# EAGLE board Glowdeck_beta_proto (EAGLE 6.3), part 1 of 2
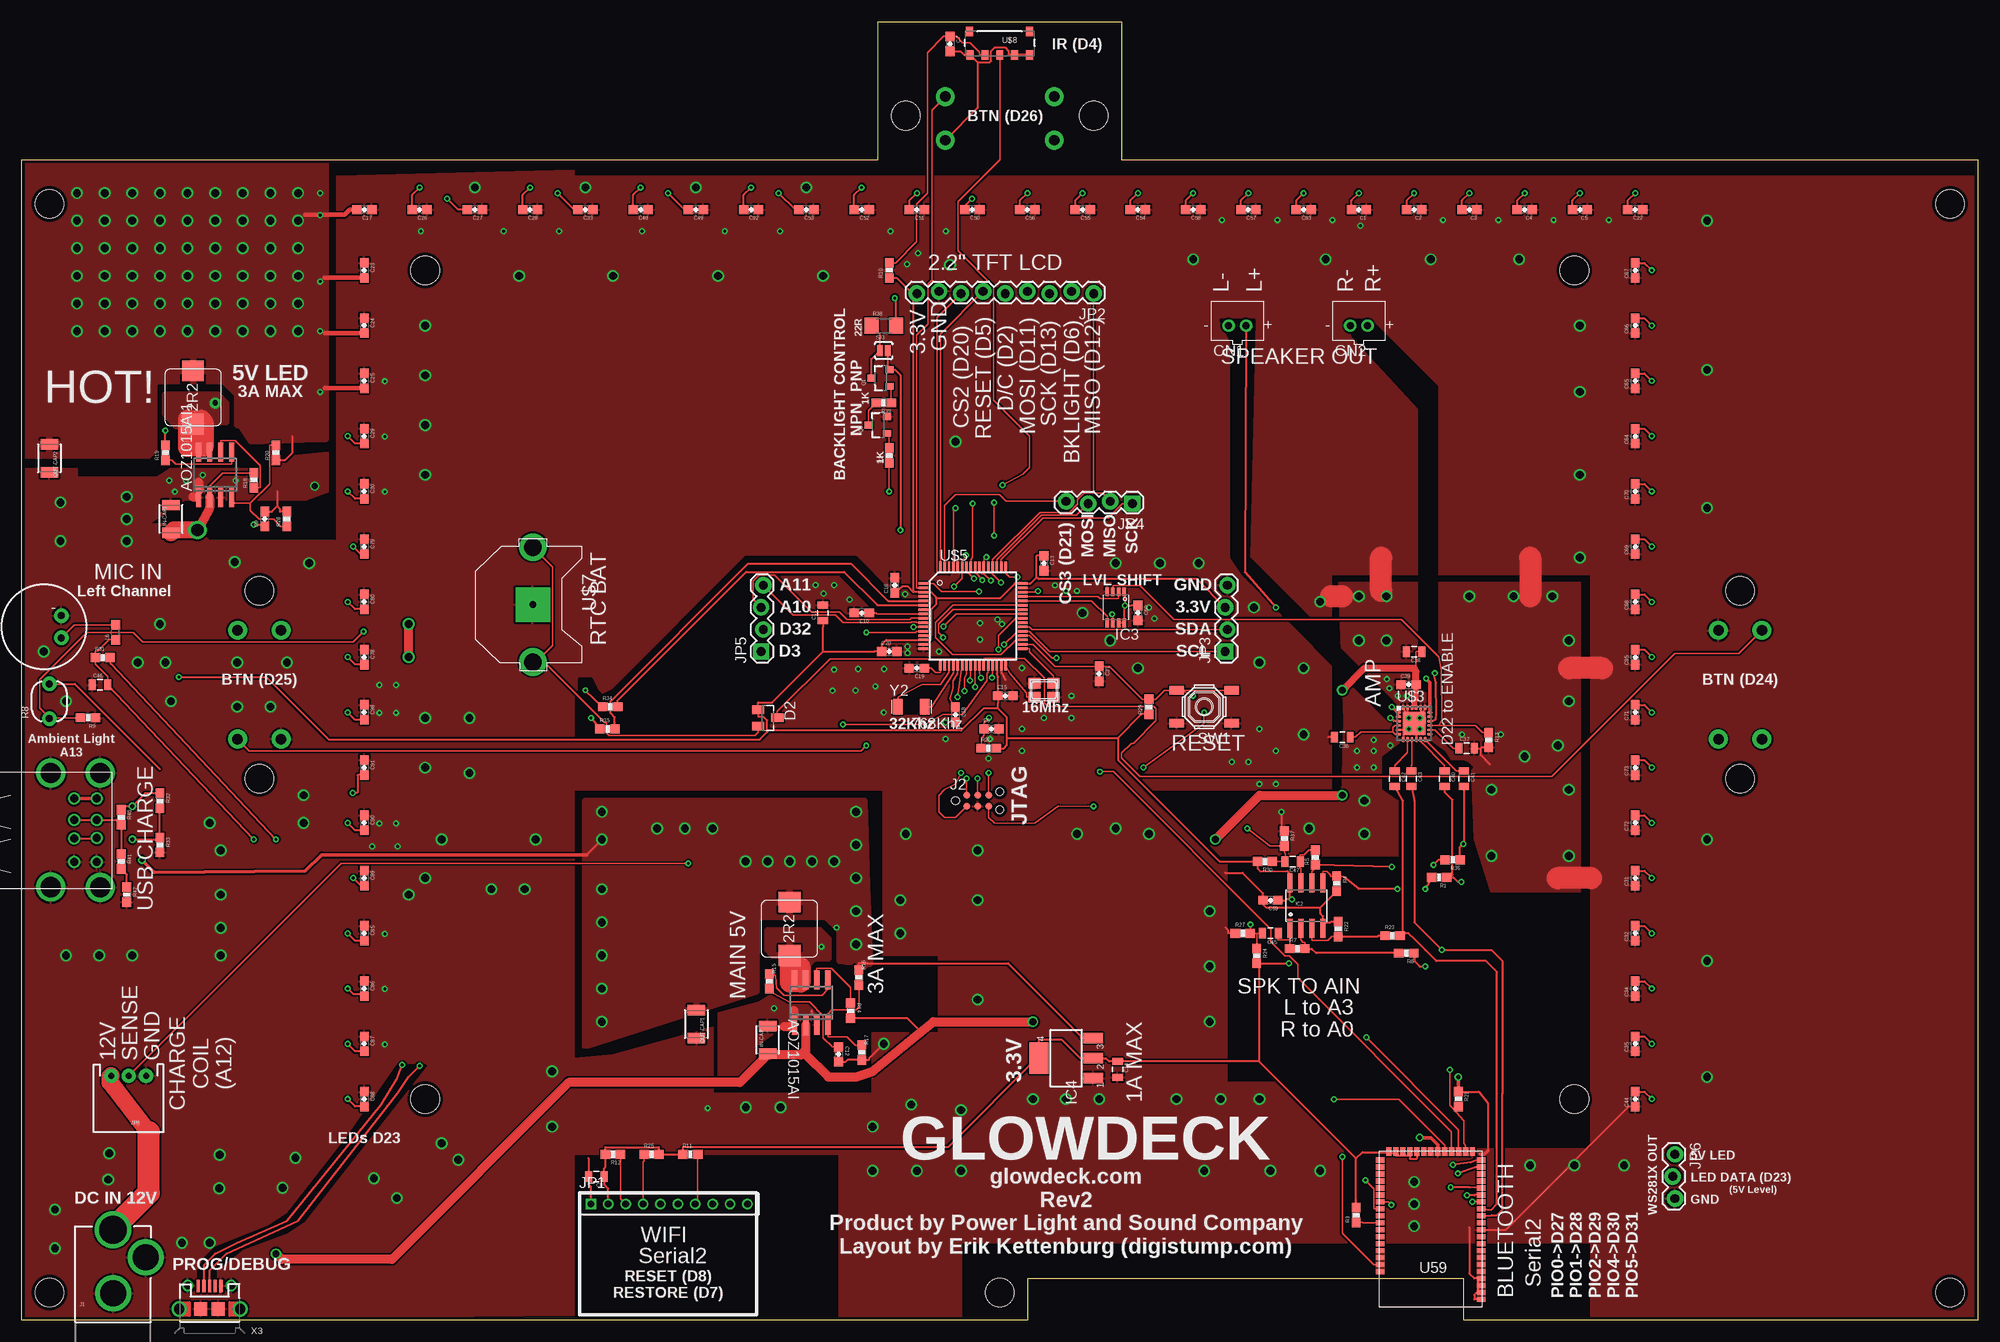
[diagram p12: board, top side]
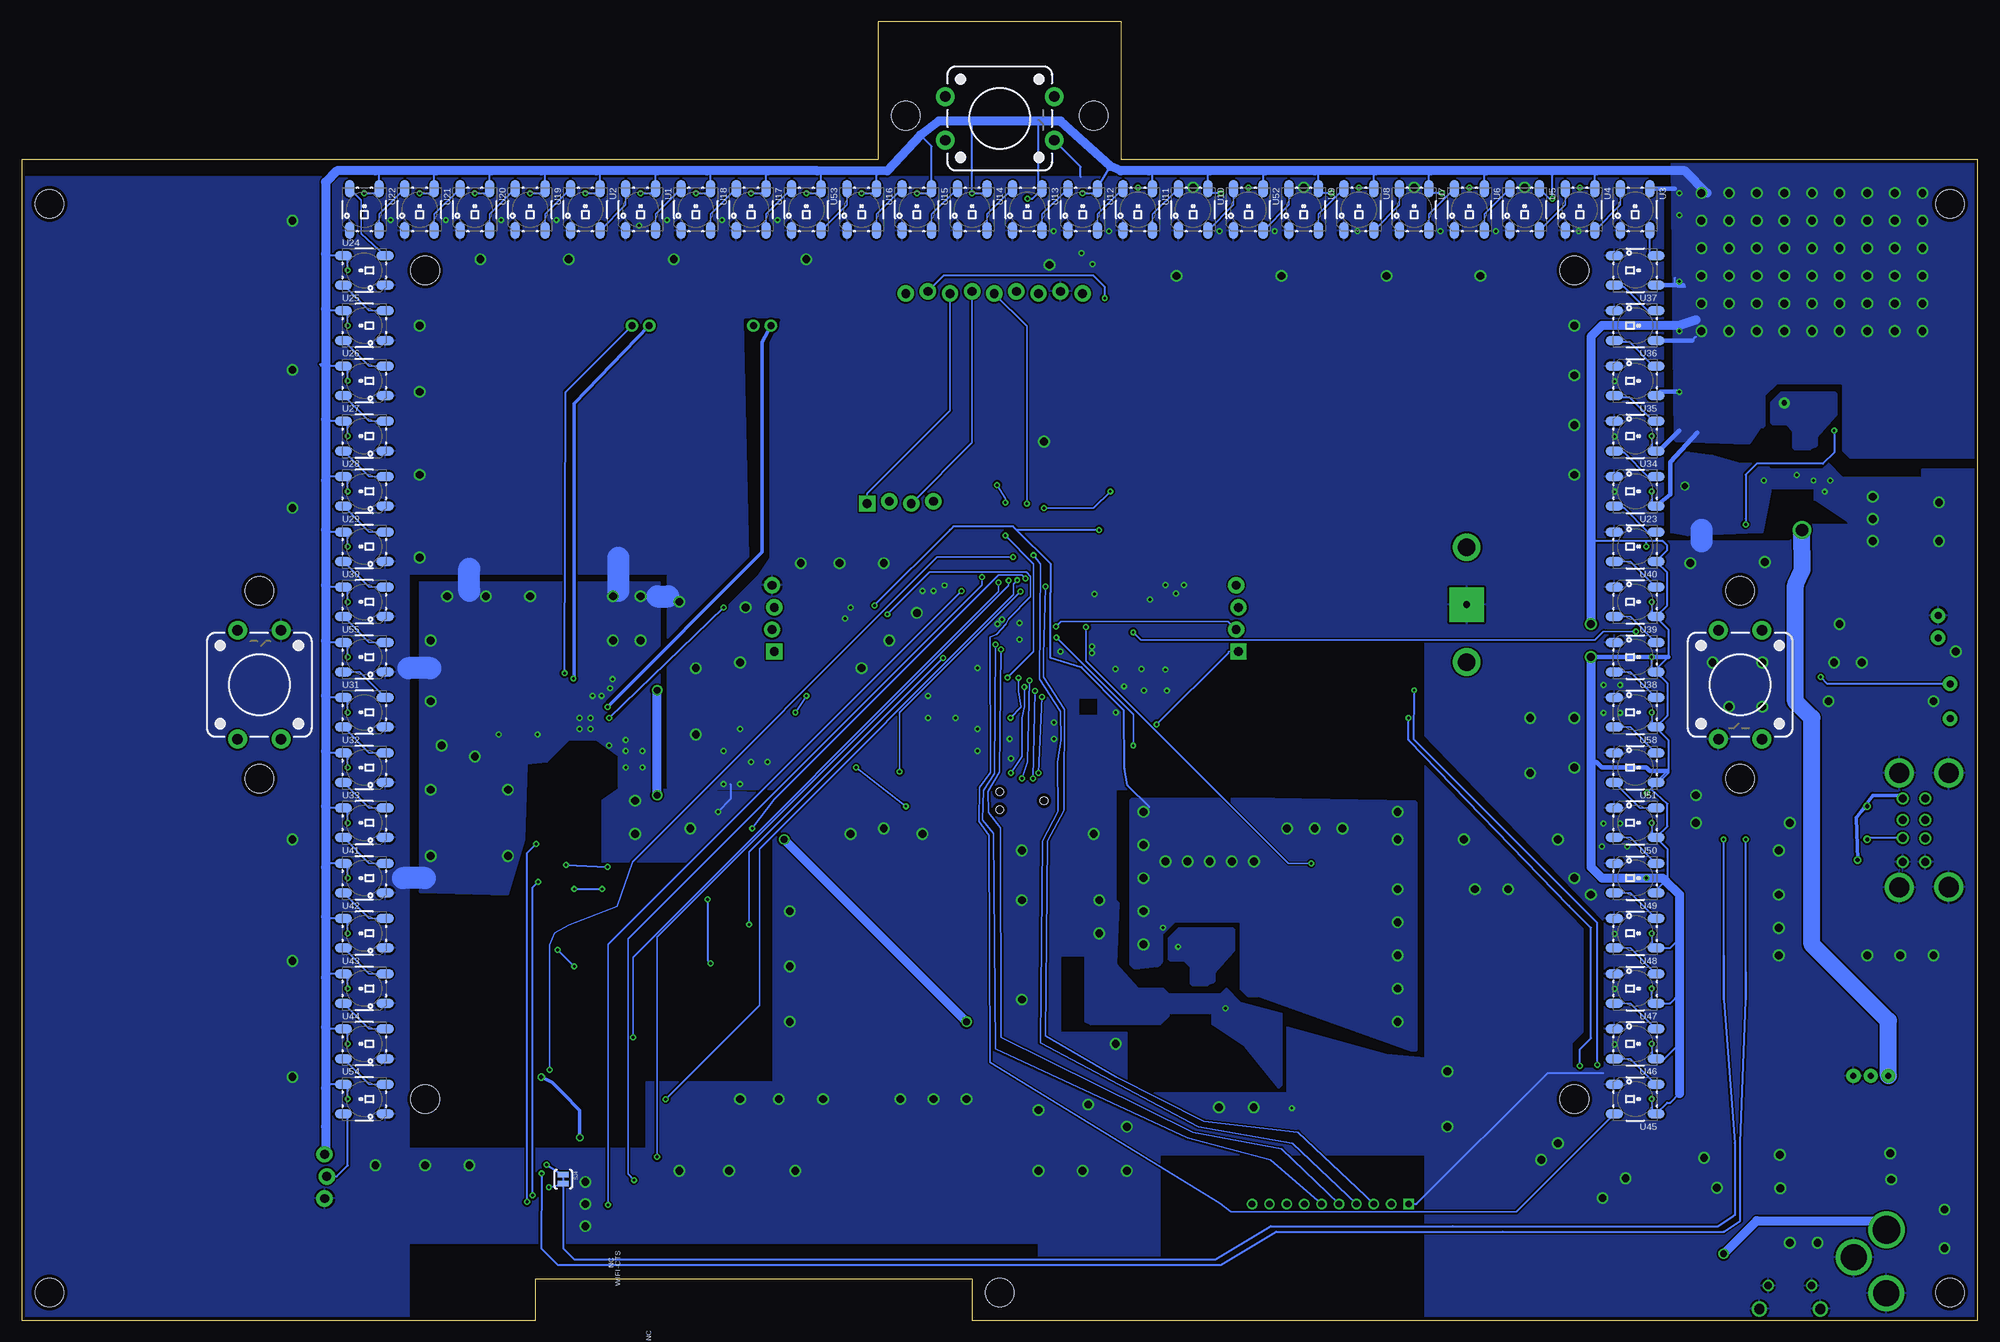
[diagram p13: board, bottom side, seen from below]

Size 224.79 x 149.22 mm. Coordinates in mm from the lower left corner, seen from the top.
Outline: 224.79,0 199.39,0 189.23,0 165.74,0 165.74,4.75 115.57,4.75 115.57,0 34.29,0 0,0 0,44.45 0,87.63 0,133.35 98.42,133.35 98.42,149.22 112.39,149.22 126.36,149.22 126.36,133.35 224.79,133.35 224.79,0
Copper layers (1*16): Top 0.0356mm / dielectric 1.5011mm / Bottom 0.0356mm
Design rules "LaenPCBOrder *": minimum track width 6mil, minimum drill 13mil, track to track 6mil, track to pad 6mil, pad to pad 6mil, via to via 6mil, smd to smd 6mil, copper to edge 15mil, drill to drill 6mil, minimum pad ring 7mil, minimum via ring 7mil, stop-mask expansion 3mil, vias tented up to drill 20mil, thermal gap 10mil
Net classes: 0 default: width 0.152 mm, clearance 0.152 mm; 1 USB: width 0.203 mm, clearance 0.203 mm to class 0, clearance 0.305 mm; 2 gnd: width 0.203 mm, clearance 0.203 mm to class 0, clearance 0.203 mm to class 1, clearance 0.203 mm; 3 usbvcc: width 0.279 mm, clearance 0.254 mm to class 0, clearance 0.406 mm to class 1, clearance 0.406 mm to class 2, clearance 0.254 mm; 4 +3V3: width 0.254 mm, clearance 0.203 mm to class 0, clearance 0.203 mm to class 1, clearance 0.203 mm to class 2, clearance 0.203 mm to class 3, clearance 0.203 mm; 5 5VLED: width 0.508 mm, clearance 0.203 mm to class 0, clearance 0.203 mm to class 1, clearance 0.203 mm to class 2, clearance 0.203 mm to class 3, clearance 0.203 mm to class 4, clearance 0.203 mm; 6 5v: width 0.254 mm, clearance 0.152 mm to class 0, clearance 0.152 mm to class 1, clearance 0.152 mm to class 2, clearance 0.152 mm to class 3, clearance 0.152 mm to class 4, clearance 0.152 mm to class 5, clearance 0.152 mm; 7 VIN: width 1.27 mm; 8 SPK: clearance 0.305 mm to class 0, clearance 0.305 mm to class 1, clearance 0.305 mm to class 2, clearance 0.305 mm to class 3, clearance 0.305 mm to class 4, clearance 0.305 mm to class 5, clearance 0.305 mm to class 6, clearance 0.305 mm to class 7
tRestrict: area 152.4,72.4 to 162.6,114.9; area 137.8,69.2 to 157.5,114.9; area 20.3,3.2 to 46.4,29.2; area 64.1,71.1 to 101.6,87.6
bRestrict: area 137.8,69.2 to 157.5,114.9; area 137.8,69.2 to 157.5,114.9; area 43.2,29.2 to 66,67.3

## Footprints (pad centres in the part's own frame; a part is rotated, then mirrored left to right if it is on the bottom)
$SO-08$DIGISTUMP$ = smd 0.6 x 2.2: 1 -1.905,-2.6; 2 -0.635,-2.6; 3 0.635,-2.6; 4 1.905,-2.6; 5 1.905,2.6; 6 0.635,2.6; 7 -0.635,2.6; 8 -1.905,2.6
SO-08 = smd 0.6 x 2.2: 1 -1.905,-2.6; 2 -0.635,-2.6; 3 0.635,-2.6; 4 1.905,-2.6; 5 1.905,2.6; 6 0.635,2.6; 7 -0.635,2.6; 8 -1.905,2.6
0603-CAP = smd 1.1 x 1: 1 -0.85,0; 2 0.85,0
0805 = smd 0.8 x 1.2: 1 -0.9,0; 2 0.9,0
$0603-CAP$SPARKFUN$ = smd 1.1 x 1: 1 -0.85,0; 2 0.85,0
SPARKFUN$ = smd 0.8 x 1.2: 1 -0.9,0; 2 0.9,0
JST-PH-2-THM = drill 0.8 pad 1.422: 1 1,0; 2 -1,0
SOT23 = smd 1 x 1.4: 1 -0.95,-1.1; 2 0.95,-1.1; 3 0,1.1
SO08 = smd 0.61 x 2.21: 1 -1.905,-2.616; 2 -0.635,-2.616; 3 0.635,-2.616; 4 1.905,-2.616; 5 1.905,2.616; 6 0.635,2.616; 7 -0.635,2.616; 8 -1.905,2.616
SSOP08 = smd 0.4 x 1: 1 -0.975,-1.8; 2 -0.325,-1.8; 3 0.325,-1.8; 4 0.975,-1.8; 5 0.975,1.8; 6 0.325,1.8; 7 -0.325,1.8; 8 -0.975,1.8
LINEAR$ = smd 1.219 x 2.235: 1 -2.311,-3.099; 2 0,-3.099; 3 2.311,-3.099 | smd 3.6 x 2.2: 4 0,3.099
$1210$SPARKFUN$ = smd 1.2 x 2: 1 -1.6,0; 2 1.6,0
1210 = smd 1.2 x 2: 1 -1.6,0; 2 1.6,0
POWER_JACK_PTH_LOCK = drill 2.997 pad 4.115: GND 0.025,6.557; GNDBREAK 3.762,10.7 | drill 3.2 pad 4.115: PWR 0,13.878
TC2030-MCP-NL = smd 0.787 x 0.787: 1 1.27,-0.635; 2 1.27,0.635; 3 2.54,-0.635; 4 2.54,0.635; 5 3.81,-0.635; 6 3.81,0.635 | hole 0.889: 0,0; 5.08,-1.016; 5.08,1.016
1X10-2MM = drill 0.8 square: 1 0,0 | drill 0.8: 2 2,0; 3 4,0; 4 6,0; 5 8,0; 6 10,0; 7 12,0; 8 14,0; 9 16,0; 10 18,0
1X09_LOCK = drill 1.016 pad 1.88: 1 0,0.127; 2 2.54,-0.127; 3 5.08,0.127; 4 7.62,-0.127; 5 10.16,0.127; 6 12.7,-0.127; 7 15.24,0.127; 8 17.78,-0.127; 9 20.32,0.127
1X04_LOCK = drill 1.016 pad 1.88 square: 1 0,0.127 | drill 1.016 pad 1.88: 2 2.54,-0.127; 3 5.08,0.127; 4 7.62,-0.127
1X03_LOCK = drill 1.016 pad 1.88: 1 0,0.127; 2 2.54,-0.127; 3 5.08,0.127
JST-3-PTH = drill 0.7 pad 1.626: 1 -2,-5; 2 0,-5; 3 2,-5
0603 = smd 1.1 x 1: 1 -0.85,0; 2 0.85,0
SOT23-3 = smd 0.8 x 0.9: 1 -0.95,-1; 2 0.95,-1; 3 0,1.1
NX3225 = smd 1.4 x 1.2: 1 -1.1,-0.8; 2 1.1,-0.8; 3 1.1,0.8; 4 -1.1,0.8
0603-RES = smd 1.1 x 1: 1 -0.85,0; 2 0.85,0
PHOTOCELL = drill 0.8 pad 1.676: 1 -2,0; 2 2,0
$0603-RES$SPARKFUN$ = smd 1.1 x 1: 1 -0.85,0; 2 0.85,0
1206 = smd 1.6 x 1.8: 1 -1.4,0; 2 1.4,0
TACTILE-PTH-12MM = drill 1.2 pad 2.159: 1 6.25,-2.5; 2 -6.25,-2.5; 3 6.25,2.5; 4 -6.25,2.5
SJ_2S-NO = smd 0.635 x 1.27: 1 -0.45,0; 2 0.45,0
SJ_2S-TRACE = smd 0.635 x 1.27: 1 -0.508,0; 2 0.508,0
STAND-OFF = hole 3.302: 0,0
SW_TACT_SMALL = smd 1.7 x 1: 1 -3.15,1.9; 2 3.15,1.9; 3 -3.15,-1.9; 4 3.15,-1.9
LED-TRICOLOR-5050-IC = smd 2 x 1.1: 1 -2.4,1.7; 2 -2.4,-1.7; 3 2.4,-1.7; 4 2.4,1.7
BC127_XTRA_PASTE = smd 1 x 0.6: 1 -5.8,8.1; 2 -5.8,7.3; 3 -5.8,6.5; 4 -5.8,5.7; 5 -5.8,4.9; 6 -5.8,4.1; 7 -5.8,3.3; 8 -5.8,2.5; 9 -5.8,1.7; 10 -5.8,0.9; 11 -5.8,0.1; 12 -5.8,-0.7; 13 -5.8,-1.5; 14 -5.8,-2.3; 15 -5.8,-3.1; 16 -5.8,-3.9; 17 -5.8,-4.7; 18 -5.8,-5.5; 19 -5.8,-6.3; 20 -5.8,-7.1; 21 -5.8,-7.9; 35 5.8,-7.9; 36 5.8,-7.1; 37 5.8,-6.3; 38 5.8,-5.5; 39 5.8,-4.7; 40 5.8,-3.9; 41 5.8,-3.1; 42 5.8,-2.3; 43 5.8,-1.5; 44 5.8,-0.7; 45 5.8,0.1; 46 5.8,0.9; 47 5.8,1.7; 48 5.8,2.5; 49 5.8,3.3; 50 5.8,4.1; 51 5.8,4.9 | smd 0.6 x 1: 22 -4.8,-8.9; 23 -4,-8.9; 24 -3.2,-8.9; 25 -2.4,-8.9; 26 -1.6,-8.9; 27 -0.8,-8.9; 28 0,-8.9; 29 0.8,-8.9; 30 1.6,-8.9; 31 2.4,-8.9; 32 3.2,-8.9; 33 4,-8.9; 34 4.8,-8.9
$SRP7030$DIGISTUMP$ = smd 2.4 x 2.5: 1 -3.05,0; 2 3.05,0
SRP7030 = smd 2.4 x 2.5: 1 -3.05,0; 2 3.05,0
TQFN24-EP = smd 0.6 x 0.3: 1 -1.825,1.25; 2 -1.825,0.75; 3 -1.825,0.25; 4 -1.825,-0.25; 5 -1.825,-0.75; 6 -1.825,-1.25; 13 1.825,-1.25; 14 1.825,-0.75; 15 1.825,-0.25; 16 1.825,0.25; 17 1.825,0.75; 18 1.825,1.25 | smd 0.3 x 0.6: 7 -1.25,-1.825; 8 -0.75,-1.825; 9 -0.25,-1.825; 10 0.25,-1.825; 11 0.75,-1.825; 12 1.25,-1.825; 19 1.25,1.825; 20 0.75,1.825; 21 0.25,1.825; 22 -0.25,1.825; 23 -0.75,1.825; 24 -1.25,1.825 | smd 2.63 x 2.63: EXP 0,0
MIC-9.7MM = drill 0.8 pad 1.676: 1 -2,1.27; 2 -2,-1.27
MK20DX128VLH5 = smd 1.1 x 0.285: 1 -5.605,3.385; 2 -5.605,2.885; 3 -5.605,2.385; 4 -5.605,1.885; 5 -5.605,1.385; 6 -5.605,0.885; 7 -5.605,0.385; 8 -5.605,-0.115; 9 -5.605,-0.615; 10 -5.605,-1.115; 11 -5.605,-1.615; 12 -5.605,-2.115; 13 -5.605,-2.615; 14 -5.605,-3.115; 15 -5.605,-3.615; 16 -5.605,-4.115; 33 5.795,-4.115; 34 5.795,-3.615; 35 5.795,-3.115; 36 5.795,-2.615; 37 5.795,-2.115; 38 5.795,-1.615; 39 5.795,-1.115; 40 5.795,-0.615; 41 5.795,-0.115; 42 5.795,0.385; 43 5.795,0.885; 44 5.795,1.385; 45 5.795,1.885; 46 5.795,2.385; 47 5.795,2.885; 48 5.795,3.385 | smd 0.285 x 1.1: 17 -3.655,-6.065; 18 -3.155,-6.065; 19 -2.655,-6.065; 20 -2.155,-6.065; 21 -1.655,-6.065; 22 -1.155,-6.065; 23 -0.655,-6.065; 24 -0.155,-6.065; 25 0.345,-6.065; 26 0.845,-6.065; 27 1.345,-6.065; 28 1.845,-6.065; 29 2.345,-6.065; 30 2.845,-6.065; 31 3.345,-6.065; 32 3.845,-6.065; 49 3.845,5.335; 50 3.345,5.335; 51 2.845,5.335; 52 2.345,5.335; 53 1.845,5.335; 54 1.345,5.335; 55 0.845,5.335; 56 0.345,5.335; 57 -0.155,5.335; 58 -0.655,5.335; 59 -1.155,5.335; 60 -1.655,5.335; 61 -2.155,5.335; 62 -2.655,5.335; 63 -3.155,5.335; 64 -3.655,5.335
DUAL-PORT-USB = drill 2.311: GND -7.645,0.127; P$2 -7.62,-5.563; P$3 5.512,0.127; P$4 5.486,-5.563 | drill 0.92: P$5 -2.261,-2.87; P$6 -0.127,-2.87; P$7 -2.261,-0.254; P$8 -0.152,-0.254; P$9 2.591,-2.87; P$10 -4.699,-2.87; P$11 2.591,-0.254; P$12 -4.699,-0.254
CR1220-THM = drill 2 pad 3.175: +1 -6.604,0; +2 6.604,0 | drill 0.8 pad 3.962 square: - 0,0
TSOP8523 = smd 0.8 x 1.1: 1 3.4,0; 2 1.7,0; 3 0,0; 4 -1.7,0; 5 -3.4,0; P$1 -3.4,-2.7; P$2 3.5,-2.7
USB-MICROB = smd 0.35 x 1.4: D+ 0,2.65; D- -0.65,2.65; GND 1.3,2.65; ID 0.65,2.65; VBUS -1.3,2.65 | smd 1.5 x 1.55: P1 -1,0; P2 1,0 | drill 1.15 pad 1.422: P3 -3.5,0; P4 3.5,0 | drill 0.85 pad 1.27: P5 -2.5,2.7; P6 2.5,2.7
RESONATOR_EPSON_FC_145 = smd 1.1 x 1.8: P$1 -1.55,0; P$2 1.55,0

## Placement (x,y rotation side)
AOZ1015AI  AOZ1021  [$SO-08$DIGISTUMP$]  90.73,36.48 0 top
AOZ1015AI1  AOZ1021  [SO-08]  22.23,97.16 0 top
C1  100nf  [0603-CAP]  153.67,127.64 180 top
C2  100nf  [0603-CAP]  160.02,127.64 180 top
C3  100nf  [0603-CAP]  166.37,127.64 180 top
C4  100nf  [0603-CAP]  172.72,127.64 180 top
C5  100nf  [0603-CAP]  179.07,127.64 180 top
C6  0.1uF  [0603-CAP]  111.44,67.94 0 top
C7  0.1uf  [0603-CAP]  106.68,146.69 270 top
C8  10uf  [0805]  66.04,16.51 180 top
C9  10nf  [0603-CAP]  27.94,92.08 90 top
C10  0.1uF  [0603-CAP]  96.52,81.28 180 top
C11  10uF  [0805]  92.08,81.28 90 top
C12  10nf  [$0603-CAP$SPARKFUN$]  93.88,30.55 270 top
C13  0.1uF  [0603-CAP]  117.47,87 270 top
C14  10uf  [SPARKFUN$]  125.93,28.82 270 top
C15  0.1uF  [0603-CAP]  113.03,71.75 0 top
C16  0.1uF  [0603-CAP]  100.33,84.45 90 top
C17  100nf  [0603-CAP]  39.37,127.64 180 top
C18  0.1uF  [0603-CAP]  107.29,69.57 270 top
C19  0.1uF  [0603-CAP]  102.87,74.93 180 top
C20  0.1uF  [0603-CAP]  99.69,76.83 0 top
C21  0.1uF  [0603-CAP]  123.83,74.3 270 top
C22  100nf  [0603-CAP]  185.42,127.64 180 top
C23  100nf  [0603-CAP]  39.37,120.65 270 top
C24  100nf  [0603-CAP]  39.37,114.3 270 top
C25  100nf  [0603-CAP]  39.37,107.95 270 top
C26  100nf  [0603-CAP]  45.72,127.64 180 top
C27  100nf  [0603-CAP]  52.07,127.64 180 top
C28  100nf  [0603-CAP]  58.42,127.64 180 top
C29  100nf  [0603-CAP]  39.37,101.6 270 top
C30  100nf  [0603-CAP]  39.37,95.25 270 top
C31  100nf  [0603-CAP]  185.42,50.8 90 top
C32  100nf  [0603-CAP]  185.42,44.45 90 top
C33  100nf  [0603-CAP]  64.77,127.64 180 top
C34  100nf  [0603-CAP]  185.42,38.1 90 top
C35  100nf  [0603-CAP]  185.42,31.75 90 top
C36  1uf  [0805]  151.76,66.99 180 top
C37  1uf  [0805]  166.05,65.72 0 top
C38  1uf  [0805]  160.02,76.83 180 top
C39  200nf  [0603-CAP]  159.38,73.03 0 top
C40  1uf  [0805]  163.51,62.23 270 top
C41  1uf  [0805]  165.74,62.23 270 top
C42  1uf  [0805]  157.8,62.23 270 top
C43  1uf  [0805]  159.7,62.23 270 top
C44  100nf  [0603-CAP]  185.42,25.4 90 top
C45  1uf  [0805]  143.51,44.45 180 top
C46  15pf  [0805]  8.99,73.01 0 top
C47  1uf  [0805]  146.05,52.7 180 top
C48  100nf  [0603-CAP]  71.12,127.64 180 top
C49  100nf  [0603-CAP]  77.47,127.64 180 top
C50  100nf  [0603-CAP]  109.22,127.64 180 top
C51  100nf  [0603-CAP]  102.87,127.64 180 top
C52  100nf  [0603-CAP]  96.52,127.64 180 top
C53  100nf  [0603-CAP]  90.17,127.64 180 top
C54  100nf  [0603-CAP]  128.27,127.64 180 top
C55  100nf  [0603-CAP]  121.92,127.64 180 top
C56  100nf  [0603-CAP]  115.57,127.64 180 top
C57  100nf  [0603-CAP]  140.97,127.64 180 top
C58  100nf  [0603-CAP]  134.62,127.64 180 top
C59  0.1uf  [0603-CAP]  143.51,48.26 180 top
C60  0.1uF  [0603-CAP]  128.27,81.28 270 top
C64  100nf  [0603-CAP]  185.42,101.6 90 top
C65  100nf  [0603-CAP]  185.42,107.95 90 top
C66  100nf  [0603-CAP]  185.42,114.3 90 top
C67  100nf  [0603-CAP]  185.42,120.65 90 top
C68  100nf  [0603-CAP]  185.42,82.55 90 top
C69  100nf  [0603-CAP]  185.42,88.9 90 top
C70  100nf  [0603-CAP]  185.42,95.25 90 top
C71  100nf  [0603-CAP]  185.42,69.85 90 top
C72  100nf  [0603-CAP]  185.42,57.15 90 top
C73  100nf  [0603-CAP]  185.42,63.5 90 top
C78  100nf  [0603-CAP]  39.37,76.2 270 top
C79  100nf  [0603-CAP]  39.37,88.9 270 top
C80  100nf  [0603-CAP]  39.37,82.55 270 top
C85  100nf  [0603-CAP]  39.37,44.45 270 top
C86  100nf  [0603-CAP]  39.37,38.1 270 top
C87  100nf  [0603-CAP]  39.37,31.75 270 top
C88  100nf  [0603-CAP]  39.37,25.4 270 top
C89  100nf  [0603-CAP]  39.37,50.8 270 top
C90  100nf  [0603-CAP]  39.37,57.15 270 top
C91  100nf  [0603-CAP]  39.37,63.5 270 top
C92  100nf  [0603-CAP]  83.82,127.64 180 top
C93  100nf  [0603-CAP]  147.32,127.64 180 top
C95  100nf  [0603-CAP]  185.42,76.2 90 top
C98  100nf  [0603-CAP]  39.37,69.85 270 top
CN1  [JST-PH-2-THM]  139.7,114.3 0 top
CN2  [JST-PH-2-THM]  153.67,114.3 0 top
D2  BAT54C  [SOT23]  85.72,69.22 270 top
IC2  OPAMP-DUALU  [SO08]  147.64,47.62 0 top
IC3  74LVC2G125DCT  [SSOP08]  125.73,81.92 180 top
IC4  NCP1117ST33T3G -3V3  [LINEAR$]  120.02,30.1 90 top
IN-CAP  22uf  [$1210$SPARKFUN$]  85.73,32.21 90 top
IN-CAP1  22uf  [1210]  17.14,92.08 90 top
J1  POWER_JACKPTH_LOCK  [POWER_JACK_PTH_LOCK]  10.48,-3.49 0 top
J2  [TC2030-MCP-NL]  107.31,59.69 0 top
JP1  M102MM  [1X10-2MM]  65.41,13.34 0 top
JP2  M09LOCK  [1X09_LOCK]  123.19,118.11 180 top
JP3  [1X04_LOCK]  138.43,76.83 90 top
JP4  [1X04_LOCK]  127.64,93.98 180 top
JP5  [1X04_LOCK]  85.09,76.83 90 top
JP6  [1X03_LOCK]  189.87,19.05 270 top
JP8  [JST-3-PTH]  12.28,23.08 180 top
L6  15nH  [0603]  10.79,79.06 90 top
OUT-CAP1  22uf  [$1210$SPARKFUN$]  77.53,34.02 270 top
OUT-CAP2  22uf  [1210]  3.17,99.06 270 top
Q1  MMBT3906  [SOT23-3]  98.74,108.27 90 top
Q2  [NX3225]  117.47,72.39 180 top
Q3  MMBT2222  [SOT23-3]  98.42,102.87 90 top
R1  10K  [0603-RES]  162.89,50.88 180 top
R2  1K  [0603-RES]  99.69,99.38 90 top
R3  10K  [0603-RES]  153.35,12.06 90 top
R4  16K  [0603-RES]  151.13,50.16 270 top
R5  16K  [0603-RES]  148.68,53.17 90 top
R6  10K  [0603-RES]  159.12,42.18 180 top
R7  16K  [0603-RES]  146.6,42.68 0 top
R8  PHOTOCELLPTH  [PHOTOCELL]  3.17,71.12 90 top
R9  10K  [0603-RES]  7.62,69.22 180 top
R10  33R  [0603-RES]  99.69,120.65 90 top
R11  10K  [0603-RES]  76.83,19.05 0 top
R12  10K  [0603-RES]  67.94,19.05 180 top
R13  10K  [0603-RES]  168.59,66.67 270 top
R14  10k  [$0603-RES$SPARKFUN$]  95.25,35.56 270 top
R15  10k  [$0603-RES$SPARKFUN$]  85.91,38.93 270 top
R16  52k  [$0603-RES$SPARKFUN$]  96.2,39.37 270 top
R17  10k  [$0603-RES$SPARKFUN$]  96.54,30.75 270 top
R18  10k  [0603-RES]  26.67,96.52 90 top
R19  10k  [0603-RES]  16.51,99.69 90 top
R20  52k  [0603-RES]  29.21,99.69 90 top
R21  10K  [0603-RES]  165.1,25.4 270 top
R22  16K  [0603-RES]  151.28,44.93 270 top
R23  10K  [0603-RES]  157.53,44.17 0 top
R24  10K  [0603-RES]  141.94,41.86 270 top
R25  10k  [0603-RES]  72.39,19.05 0 top
R26  10K  [0603-RES]  111.12,65.72 0 top
R27  10K  [0603-RES]  140.34,44.45 0 top
R28  10k  [0603-RES]  30.48,92.08 90 top
R29  10K  [0603-RES]  129.54,70.48 90 top
R30  10K  [0603-RES]  142.88,52.7 180 top
R31  2.2K  [0603-RES]  9.31,76.14 0 top
R32  1.5K  [0603-RES]  15.88,59.69 270 top
R33  1K  [0603-RES]  15.88,54.61 270 top
R34  33  [0603-RES]  67.63,70.48 0 top
R35  33  [0603-RES]  67.31,67.94 0 top
R36  10K  [0603-RES]  164.45,52.9 180 top
R37  10K  [0603-RES]  145.11,55.35 270 top
R38  22R  [1206]  99.06,114.3 0 top
R39  1K  [0603-RES]  99.06,105.41 180 top
R40  10K  [0603-RES]  11.43,57.78 270 top
R41  2.2K  [0603-RES]  11.43,52.7 270 top
R42  10K  [0603-RES]  12.06,48.9 270 top
S1  SWITCH-MOMENTARY-212MM  [TACTILE-PTH-12MM]  27.3,73.03 270 bottom
S3  SWITCH-MOMENTARY-212MM  [TACTILE-PTH-12MM]  112.39,138.11 0 bottom
S4  SWITCH-MOMENTARY-212MM  [TACTILE-PTH-12MM]  197.49,73.03 90 bottom
SJ3  SOLDERJUMPERNO  [SJ_2S-NO]  99.06,111.44 0 top
SJ4  SOLDERJUMPERTRACE  [SJ_2S-TRACE]  162.56,16.19 270 bottom
STANDOFF1  STAND-OFF  [STAND-OFF]  46.35,25.4 0 top
STANDOFF2  STAND-OFF  [STAND-OFF]  178.44,120.65 0 top
STANDOFF3  STAND-OFF  [STAND-OFF]  178.44,25.4 0 top
STANDOFF4  STAND-OFF  [STAND-OFF]  46.35,120.65 0 top
STANDOFF5  STAND-OFF  [STAND-OFF]  221.62,3.17 0 top
STANDOFF6  STAND-OFF  [STAND-OFF]  3.17,3.17 0 top
STANDOFF7  STAND-OFF  [STAND-OFF]  3.17,128.27 0 top
STANDOFF8  STAND-OFF  [STAND-OFF]  221.62,128.27 0 top
STANDOFF9  STAND-OFF  [STAND-OFF]  101.6,138.43 0 top
STANDOFF10  STAND-OFF  [STAND-OFF]  27.3,62.23 0 top
STANDOFF11  STAND-OFF  [STAND-OFF]  27.3,83.82 0 top
STANDOFF12  STAND-OFF  [STAND-OFF]  197.49,83.82 0 top
STANDOFF13  STAND-OFF  [STAND-OFF]  197.49,62.23 0 top
STANDOFF14  STAND-OFF  [STAND-OFF]  123.19,138.43 0 top
STANDOFF15  STAND-OFF  [STAND-OFF]  112.39,3.17 0 top
SW1  [SW_TACT_SMALL]  135.89,70.48 180 top
U1  LED-TRICOLOR-5050-ICWS2811  [LED-TRICOLOR-5050-IC]  153.67,127.64 270 bottom
U2  LED-TRICOLOR-5050-ICWS2811  [LED-TRICOLOR-5050-IC]  160.02,127.64 270 bottom
U3  LED-TRICOLOR-5050-ICWS2811  [LED-TRICOLOR-5050-IC]  39.37,127.64 270 bottom
U4  LED-TRICOLOR-5050-ICWS2811  [LED-TRICOLOR-5050-IC]  45.72,127.64 270 bottom
U5  LED-TRICOLOR-5050-ICWS2811  [LED-TRICOLOR-5050-IC]  52.07,127.64 270 bottom
U6  LED-TRICOLOR-5050-ICWS2811  [LED-TRICOLOR-5050-IC]  58.42,127.64 270 bottom
U7  LED-TRICOLOR-5050-ICWS2811  [LED-TRICOLOR-5050-IC]  64.77,127.64 270 bottom
U8  LED-TRICOLOR-5050-ICWS2811  [LED-TRICOLOR-5050-IC]  71.12,127.64 270 bottom
U9  LED-TRICOLOR-5050-ICWS2811  [LED-TRICOLOR-5050-IC]  77.47,127.64 270 bottom
U10  LED-TRICOLOR-5050-ICWS2811  [LED-TRICOLOR-5050-IC]  90.17,127.64 270 bottom
U11  LED-TRICOLOR-5050-ICWS2811  [LED-TRICOLOR-5050-IC]  96.52,127.64 270 bottom
U12  LED-TRICOLOR-5050-ICWS2811  [LED-TRICOLOR-5050-IC]  102.87,127.64 270 bottom
U13  LED-TRICOLOR-5050-ICWS2811  [LED-TRICOLOR-5050-IC]  109.22,127.64 270 bottom
U14  LED-TRICOLOR-5050-ICWS2811  [LED-TRICOLOR-5050-IC]  115.57,127.64 270 bottom
U15  LED-TRICOLOR-5050-ICWS2811  [LED-TRICOLOR-5050-IC]  121.92,127.64 270 bottom
U16  LED-TRICOLOR-5050-ICWS2811  [LED-TRICOLOR-5050-IC]  128.27,127.64 270 bottom
U17  LED-TRICOLOR-5050-ICWS2811  [LED-TRICOLOR-5050-IC]  140.97,127.64 270 bottom
U18  LED-TRICOLOR-5050-ICWS2811  [LED-TRICOLOR-5050-IC]  147.32,127.64 270 bottom
U19  LED-TRICOLOR-5050-ICWS2811  [LED-TRICOLOR-5050-IC]  166.37,127.64 270 bottom
U20  LED-TRICOLOR-5050-ICWS2811  [LED-TRICOLOR-5050-IC]  172.72,127.64 270 bottom
U21  LED-TRICOLOR-5050-ICWS2811  [LED-TRICOLOR-5050-IC]  179.07,127.64 270 bottom
U22  LED-TRICOLOR-5050-ICWS2811  [LED-TRICOLOR-5050-IC]  185.42,127.64 270 bottom
U23  LED-TRICOLOR-5050-ICWS2811  [LED-TRICOLOR-5050-IC]  39.37,95.25 180 bottom
U24  LED-TRICOLOR-5050-ICWS2811  [LED-TRICOLOR-5050-IC]  185.42,120.65 0 bottom
U25  LED-TRICOLOR-5050-ICWS2811  [LED-TRICOLOR-5050-IC]  185.42,114.3 0 bottom
U26  LED-TRICOLOR-5050-ICWS2811  [LED-TRICOLOR-5050-IC]  185.42,107.95 0 bottom
U27  LED-TRICOLOR-5050-ICWS2811  [LED-TRICOLOR-5050-IC]  185.42,101.6 0 bottom
U28  LED-TRICOLOR-5050-ICWS2811  [LED-TRICOLOR-5050-IC]  185.42,95.25 0 bottom
U29  LED-TRICOLOR-5050-ICWS2811  [LED-TRICOLOR-5050-IC]  185.42,88.9 0 bottom
U30  LED-TRICOLOR-5050-ICWS2811  [LED-TRICOLOR-5050-IC]  185.42,82.55 0 bottom
U31  LED-TRICOLOR-5050-ICWS2811  [LED-TRICOLOR-5050-IC]  185.42,69.85 0 bottom
U32  LED-TRICOLOR-5050-ICWS2811  [LED-TRICOLOR-5050-IC]  185.42,63.5 0 bottom
U33  LED-TRICOLOR-5050-ICWS2811  [LED-TRICOLOR-5050-IC]  185.42,57.15 0 bottom
U34  LED-TRICOLOR-5050-ICWS2811  [LED-TRICOLOR-5050-IC]  39.37,101.6 180 bottom
U35  LED-TRICOLOR-5050-ICWS2811  [LED-TRICOLOR-5050-IC]  39.37,107.95 180 bottom
U36  LED-TRICOLOR-5050-ICWS2811  [LED-TRICOLOR-5050-IC]  39.37,114.3 180 bottom
U37  LED-TRICOLOR-5050-ICWS2811  [LED-TRICOLOR-5050-IC]  39.37,120.65 180 bottom
U38  LED-TRICOLOR-5050-ICWS2811  [LED-TRICOLOR-5050-IC]  39.37,76.2 180 bottom
U39  LED-TRICOLOR-5050-ICWS2811  [LED-TRICOLOR-5050-IC]  39.37,82.55 180 bottom
U40  LED-TRICOLOR-5050-ICWS2811  [LED-TRICOLOR-5050-IC]  39.37,88.9 180 bottom
U41  LED-TRICOLOR-5050-ICWS2811  [LED-TRICOLOR-5050-IC]  185.42,50.8 0 bottom
U42  LED-TRICOLOR-5050-ICWS2811  [LED-TRICOLOR-5050-IC]  185.42,44.45 0 bottom
U43  LED-TRICOLOR-5050-ICWS2811  [LED-TRICOLOR-5050-IC]  185.42,38.1 0 bottom
U44  LED-TRICOLOR-5050-ICWS2811  [LED-TRICOLOR-5050-IC]  185.42,31.75 0 bottom
U45  LED-TRICOLOR-5050-ICWS2811  [LED-TRICOLOR-5050-IC]  39.37,25.4 180 bottom
U46  LED-TRICOLOR-5050-ICWS2811  [LED-TRICOLOR-5050-IC]  39.37,31.75 180 bottom
U47  LED-TRICOLOR-5050-ICWS2811  [LED-TRICOLOR-5050-IC]  39.37,38.1 180 bottom
U48  LED-TRICOLOR-5050-ICWS2811  [LED-TRICOLOR-5050-IC]  39.37,44.45 180 bottom
U49  LED-TRICOLOR-5050-ICWS2811  [LED-TRICOLOR-5050-IC]  39.37,50.8 180 bottom
U50  LED-TRICOLOR-5050-ICWS2811  [LED-TRICOLOR-5050-IC]  39.37,57.15 180 bottom
U51  LED-TRICOLOR-5050-ICWS2811  [LED-TRICOLOR-5050-IC]  39.37,63.5 180 bottom
U52  LED-TRICOLOR-5050-ICWS2811  [LED-TRICOLOR-5050-IC]  83.82,127.64 270 bottom
U53  LED-TRICOLOR-5050-ICWS2811  [LED-TRICOLOR-5050-IC]  134.62,127.64 270 bottom
U54  LED-TRICOLOR-5050-ICWS2811  [LED-TRICOLOR-5050-IC]  185.42,25.4 0 bottom
U55  LED-TRICOLOR-5050-ICWS2811  [LED-TRICOLOR-5050-IC]  185.42,76.2 0 bottom
U58  LED-TRICOLOR-5050-ICWS2811  [LED-TRICOLOR-5050-IC]  39.37,69.85 180 bottom
U59  [BC127_XTRA_PASTE]  161.93,10.48 180 top
U$1  [$SRP7030$DIGISTUMP$]  88.23,44.98 90 top
U$2  [SRP7030]  19.68,106.05 90 top
U$3  MAX98400B  [TQFN24-EP]  160.02,68.58 0 top
U$4  MIC9.7MM  [MIC-9.7MM]  2.54,79.69 180 top
U$5  MK20DX128VLH5  [MK20DX128VLH5]  109.22,81.28 0 top
U$6  DUAL-PORT-USB-REC  [DUAL-PORT-USB]  8.89,55.24 270 top
U$7  [CR1220-THM]  58.74,82.23 270 top
U$8  IRRECEIVERSMD  [TSOP8523]  112.39,145.41 180 top
X3  USB-MICROB  [USB-MICROB]  21.59,1.27 0 top
Y2  32.768Khz  [RESONATOR_EPSON_FC_145]  102.23,70.48 0 top